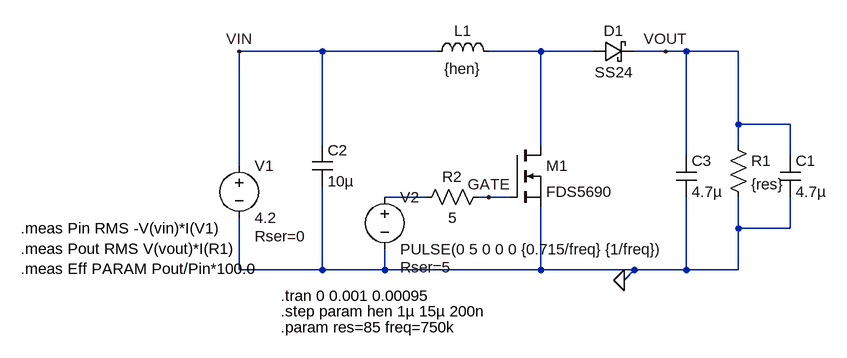
[diagram p0: schematic Boost.asc]
Boost.asc, the LTspice schematic file:
Version 4
SHEET 1 900 680
WIRE -128 -64 -256 -64
WIRE 48 -64 -128 -64
WIRE 208 -64 128 -64
WIRE 288 -64 208 -64
WIRE 400 -64 352 -64
WIRE 432 -64 400 -64
WIRE 512 -64 432 -64
WIRE 512 48 512 -64
WIRE 592 48 512 48
WIRE -128 80 -128 -64
WIRE 208 80 208 -64
WIRE 512 80 512 48
WIRE 432 96 432 -64
WIRE 592 96 592 48
WIRE -256 112 -256 -64
WIRE 32 160 -32 160
WIRE 128 160 112 160
WIRE 160 160 128 160
WIRE 512 208 512 160
WIRE 592 208 592 160
WIRE 592 208 512 208
WIRE -256 272 -256 192
WIRE -128 272 -128 144
WIRE -128 272 -256 272
WIRE -32 272 -32 240
WIRE -32 272 -128 272
WIRE 208 272 208 176
WIRE 208 272 -32 272
WIRE 352 272 208 272
WIRE 432 272 432 160
WIRE 432 272 352 272
WIRE 512 272 512 208
WIRE 512 272 432 272
WIRE 336 288 352 272
FLAG 336 288 0
FLAG 400 -64 VOUT
FLAG -256 -64 VIN
FLAG 128 160 GATE
SYMBOL nmos 160 80 R0
SYMATTR InstName M1
SYMATTR Value FDS5690
SYMBOL ind 32 -48 R270
WINDOW 0 32 56 VTop 2
WINDOW 3 5 56 VBottom 2
SYMATTR InstName L1
SYMATTR Value {hen}
SYMATTR SpiceLine Ipk=3.7 Rser=0.042 Rpar=15188 Cpar=3.369p
SYMBOL schottky 288 -48 R270
WINDOW 0 32 32 VTop 2
WINDOW 3 0 32 VBottom 2
SYMATTR InstName D1
SYMATTR Value SS24
SYMATTR Description Diode
SYMATTR Type diode
SYMBOL voltage -256 96 R0
WINDOW 123 0 0 Left 2
WINDOW 39 24 124 Left 2
SYMATTR SpiceLine Rser=0
SYMATTR InstName V1
SYMATTR Value 4.2
SYMBOL cap 576 96 R0
SYMATTR InstName C1
SYMATTR Value 4.7µ
SYMATTR SpiceLine V=25 Irms=0 Rser=0.003 Lser=0
SYMBOL voltage -32 144 R0
WINDOW 123 0 0 Left 2
WINDOW 39 24 124 Left 2
SYMATTR SpiceLine Rser=5
SYMATTR InstName V2
SYMATTR Value PULSE(0 5 0 0 0 {0.715/freq} {1/freq})
SYMBOL cap -144 80 R0
SYMATTR InstName C2
SYMATTR Value 10µ
SYMATTR SpiceLine V=25 Irms=0 Rser=0.001 Lser=0 mfg="TDK" pn="C575OX7RIE106M" type="X7R"
SYMBOL res 496 64 R0
SYMATTR InstName R1
SYMATTR Value {res}
SYMATTR SpiceLine tol=1 pwr=1
SYMBOL res 128 144 R90
WINDOW 0 0 56 VBottom 2
WINDOW 3 32 56 VTop 2
SYMATTR InstName R2
SYMATTR Value 5
SYMATTR SpiceLine tol=1 pwr=1
SYMBOL cap 416 96 R0
SYMATTR InstName C3
SYMATTR Value 4.7µ
SYMATTR SpiceLine V=25 Irms=0 Rser=0.003 Lser=0
TEXT -192 312 Left 2 !.tran 0 0.001 0.00095
TEXT -192 336 Left 2 !.step param hen 1µ 15µ 200n
TEXT -592 208 Left 2 !.meas Pin RMS -V(vin)*I(V1)\n.meas Pout RMS V(vout)*I(R1)\n.meas Eff PARAM Pout/Pin*100.0
TEXT -192 360 Left 2 !.param res=85 freq=750k

The netlist it stands for:
* Boost.asc
M1 N001 GATE 0 0 FDS5690
L1 VIN N001 {hen} Ipk=3.7 Rser=0.042 Rpar=15188 Cpar=3.369p
D1 N001 VOUT SS24
V1 VIN 0 4.2 Rser=0
C1 VOUT 0 4.7µ V=25 Irms=0 Rser=0.003 Lser=0
V2 N002 0 PULSE(0 5 0 0 0 {0.715/freq} {1/freq}) Rser=5
C2 VIN 0 10µ V=25 Irms=0 Rser=0.001 Lser=0 mfg="TDK" pn="C575OX7RIE106M" type="X7R"
R1 VOUT 0 {res} tol=1 pwr=1
R2 GATE N002 5 tol=1 pwr=1
C3 VOUT 0 4.7µ V=25 Irms=0 Rser=0.003 Lser=0
.model D D
.lib standard.dio
.model NMOS NMOS
.model PMOS PMOS
.lib standard.mos
.tran 0 0.001 0.00095
.step param hen 1µ 15µ 200n
.meas Pin RMS -V(vin)*I(V1)
.meas Pout RMS V(vout)*I(R1)
.meas Eff PARAM Pout/Pin*100.0
.param res=85 freq=750k
.backanno
.end